# Altium schematic sheet bolid-rs485-usb-sd.SchDoc
size A3
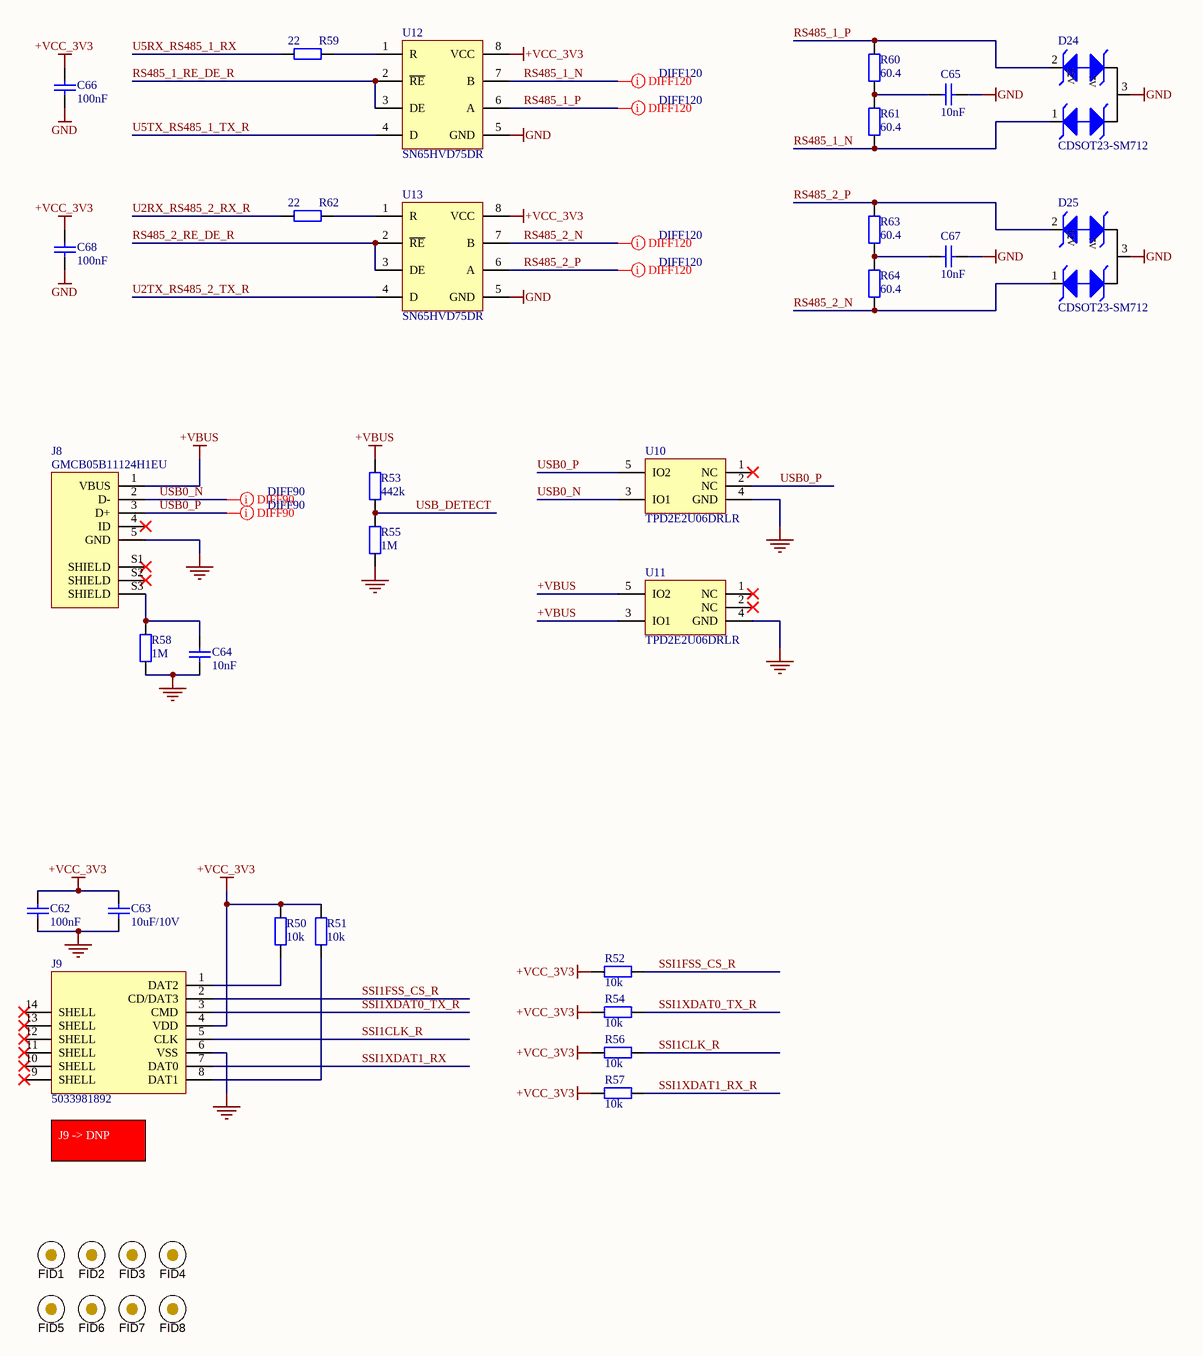
[diagram p0: bolid-rs485-usb-sd.SchDoc]

## Parts
C62  Value Displayed: 100nF  [C0402-CAPC100X50X55L22 - Tayio Yuden TDK]  (hidden comment: GRM155R71H104KE14D)
C63  Value Displayed: 10uF/10V  [C0805-CAPC200X125X135L50N - Taiyo YudenN]  (hidden comment: GRM21BR71A106KA73K)
C64  Value Displayed: 10nF  [C0402-CAPC100X50X55L22 - Tayio Yuden TDK]  (hidden comment: GCM155R71H103KA55D)
C65  Value Displayed: 10nF  [C0402-CAPC100X50X55L22 - Tayio Yuden TDK]  (hidden comment: GCM155R71H103KA55D)
C66  Value Displayed: 100nF  [C0402-CAPC100X50X55L22 - Tayio Yuden TDK]  (hidden comment: GRM155R71H104KE14D)
C67  Value Displayed: 10nF  [C0402-CAPC100X50X55L22 - Tayio Yuden TDK]  (hidden comment: GCM155R71H103KA55D)
C68  Value Displayed: 100nF  [C0402-CAPC100X50X55L22 - Tayio Yuden TDK]  (hidden comment: GRM155R71H104KE14D)
D24  CDSOT23-SM712  [Bourns SOT-23-3L SOT23-3P95_229X117L49X40N]
D25  CDSOT23-SM712  [Bourns SOT-23-3L SOT23-3P95_229X117L49X40N]
FID1  Fiducial  [Fiducial10-20]  (value not drawn)  (no BOM)
FID2  Fiducial  [Fiducial10-20]  (value not drawn)  (no BOM)
FID3  Fiducial  [Fiducial10-20]  (value not drawn)  (no BOM)
FID4  Fiducial  [Fiducial10-20]  (value not drawn)  (no BOM)
FID5  Fiducial  [Fiducial10-20]  (value not drawn)  (no BOM)
FID6  Fiducial  [Fiducial10-20]  (value not drawn)  (no BOM)
FID7  Fiducial  [Fiducial10-20]  (value not drawn)  (no BOM)
FID8  Fiducial  [Fiducial10-20]  (value not drawn)  (no BOM)
J8  GMCB05B11124H1EU  [AMPHENOL-GMCB05B11124H1EU]
J9  5033981892  [MOLEX MICROSD 5033981892]
R50  value 10k  [R0402-RESC100X50X40L22N]  (hidden comment: RC0402FR-0710KL)
R51  value 10k  [R0402-RESC100X50X40L22N]  (hidden comment: RC0402FR-0710KL)
R52  value 10k  [R0402-RESC100X50X40L22N]  (hidden comment: RC0402FR-0710KL)
R53  value 442k  [R0402-RESC100X50X40L22N]  (hidden comment: ERJ-2RKF4423X)
R54  value 10k  [R0402-RESC100X50X40L22N]  (hidden comment: RC0402FR-0710KL)
R55  value 1M  [R0402-RESC100X50X40L22N]  (hidden comment: AC0402FR-071ML)
R56  value 10k  [R0402-RESC100X50X40L22N]  (hidden comment: RC0402FR-0710KL)
R57  value 10k  [R0402-RESC100X50X40L22N]  (hidden comment: RC0402FR-0710KL)
R58  value 1M  [R0402-RESC100X50X40L22N]  (hidden comment: AC0402FR-071ML)
R59  value 22  [R0402-RESC100X50X40L22N]  (hidden comment: RC0402FR-1322RL)
R60  value 60.4  [R0603-RESC160X80X55L30N]  (hidden comment: RC0603FR-0760R4L)
R61  value 60.4  [R0603-RESC160X80X55L30N]  (hidden comment: RC0603FR-0760R4L)
R62  value 22  [R0402-RESC100X50X40L22N]  (hidden comment: RC0402FR-1322RL)
R63  value 60.4  [R0603-RESC160X80X55L30N]  (hidden comment: RC0603FR-0760R4L)
R64  value 60.4  [R0603-RESC160X80X55L30N]  (hidden comment: RC0603FR-0760R4L)
U10  TPD2E2U06DRLR  [TI SOT-5X3 DRL0005A SOTFL50P160X60-5N]
U11  TPD2E2U06DRLR  [TI SOT-5X3 DRL0005A SOTFL50P160X60-5N]
U12  SN65HVD75DR  [TI SOIC8 D0008A SOIC8P127_490X599X175L84X41N]
U13  SN65HVD75DR  [TI SOIC8 D0008A SOIC8P127_490X599X175L84X41N]

## Nets
+VBUS: J8.1(VBUS) R53.2 U11.3(IO1) U11.5(IO2)
+VCC_3V3: C62.2 C63.1 C66.1 C68.1 J9.4(VDD) R50.1 R51.1 R52.1 R54.1 R56.1 R57.1 U12.8(VCC) U13.8(VCC)
GND: C62.1 C63.2 C64.1 C65.2 C66.2 C67.2 C68.2 D24.3 D25.3 J8.5(GND) J9.6(VSS) R55.1 R58.1 U10.4(GND) U11.4(GND) U12.5(GND) U13.5(GND)
RS485_1_N: D24.1 R61.1 U12.7(B)
RS485_1_P: D24.2 R60.2 U12.6(A)
RS485_1_RE_DE_R: U12.2(~{RE}) U12.3(DE)
RS485_2_N: D25.1 R64.1 U13.7(B)
RS485_2_P: D25.2 R63.2 U13.6(A)
RS485_2_RE_DE_R: U13.2(~{RE}) U13.3(DE)
SSI1CLK_R: J9.5(CLK) R56.2
SSI1FSS_CS_R: J9.2(CD/DAT3) R52.2
SSI1XDAT0_TX_R: J9.3(CMD) R54.2
SSI1XDAT1_RX: J9.7(DAT0)
SSI1XDAT1_RX_R: R57.2
U2RX_RS485_2_RX_R: R62.1
U2TX_RS485_2_TX_R: U13.4(D)
U5RX_RS485_1_RX: R59.1
U5TX_RS485_1_TX_R: U12.4(D)
USB0_N: J8.2(D-) U10.3(IO1)
USB0_P: J8.3(D+) U10.2(NC) U10.5(IO2)
USB_DETECT: R53.1 R55.2
NetC64_2: C64.2 J8.S3(SHIELD) R58.2
NetC65_1: C65.1 R60.1 R61.2
NetC67_1: C67.1 R63.1 R64.2
NetJ9_1: J9.1(DAT2) R50.2
NetJ9_8: J9.8(DAT1) R51.2
NetR59_2: R59.2 U12.1(R)
NetR62_2: R62.2 U13.1(R)

Not connected (* = marked no-connect by the designer): FID1 X; FID2 X; FID3 X; FID4 X; FID5 X; FID6 X; FID7 X; FID8 X; J8 4(ID)* S1(SHIELD)* S2(SHIELD)*; J9 9(SHELL)* 10(SHELL)* 11(SHELL)* 12(SHELL)* 13(SHELL)* 14(SHELL)*; U10 1(NC)*; U11 1(NC)* 2(NC)*

## Layout directives
differential pair; differential pair class DIFF120: RS485_1_N, RS485_1_P, RS485_2_N, RS485_2_P
differential pair; differential pair class DIFF90: USB0_N, USB0_P

## Notes on the sheet
- (near J9) J9 -> DNP
- (in symbol CDSOT23-SM712) 7V

## Library data of the parts
C62 C66 C68 = GRM155R71H104KE14D: MLCC 0402 (1005) 100nF 10% 50V X7R; Manufacturer: Murata Electronics; Capacitance: 0.1 uF; Type: Chip Multilayer Ceramic Capacitor for General Purpose; Voltage Rating DC: 50 VDC; Capacitance - pF: 100000 pF; Class: Class 2; Supplier 1: Mouser; Manufacturer Part Number: GRM155R71H104KE14D; RoHS: RoHS Compliant; Category: Multilayer Ceramic Capacitors MLCC - SMD/SMT; Stock 1: 3511637; Pricing 1: 1=0.090, 10=0.038, 100=0.016, 500=0.012, 1000=0.009, 2500=0.008, 5000=0.007, 10000=0.005 (EUR); Height: 0.5 mm; Length: 1 mm; Package / Case: 0402 (1005 metric); Packaging: Cut Tape; Product: General Type MLCCs; Series: GRM; Termination Style: SMD/SMT; Tolerance: 10 %; Width: 0.5 mm; Brand: Murata Electronics; Capacitance - nF: 100 nF; Case Code - in: 0402; Case Code - mm: 1005; Dielectric: X7R; Maximum Operating Temperature: + 125 C; Minimum Operating Temperature: - 55 C; Product Type: Ceramic Capacitors; Standard Pack Qty: 10000; Subcategory: Capacitors; Termination: Standard; RoHS - Mouser: Y; Minimum Order Quantity: 1; Reeling: True; ComponentLink1URL: https://www.mouser.com/datasheet/2/281/murata_03052018_GRM_Series_1-1310166.pdf; ComponentLink1Description: https://www.mouser.com/datasheet/2/281/murata_03052018_GRM_Series_1-1310166.pdf; Value: 100nF; Supplier Part Number 1: 81-GRM155R71H104KE4D
C63 = GRM21BR71A106KA73K: MLCC 0805 (2012) 10uF 10% 10V X7R; Manufacturer: Murata Electronics; Type: Chip Multilayer Ceramic Capacitor for General Purpose; Voltage Rating DC: 10 VDC; Class: Class 2; Value: 10u; Supplier 1: Mouser; Manufacturer Part Number: GRM21BR71A106KA73K; RoHS: RoHS Compliant; Category: Multilayer Ceramic Capacitors MLCC - SMD/SMT; Stock 1: 108729; Pricing 1: 1=0.207, 10=0.144, 100=0.072, 500=0.050, 1000=0.043, 2500=0.040, 5000=0.036, 10000=0.030, 20000=0.028 (EUR); Capacitance: 10 uF; Height: 1.25 mm; Length: 2 mm; Package / Case: 0805 (2012 metric); Packaging: Cut Tape; Product: General Type MLCCs; Series: GRM; Termination Style: SMD/SMT; Tolerance: 10 %; Width: 1.25 mm; Brand: Murata Electronics; Case Code - in: 0805; Case Code - mm: 2012; Dielectric: X7R; Maximum Operating Temperature: + 125 C; Minimum Operating Temperature: - 55 C; Product Type: Ceramic Capacitors; Standard Pack Qty: 10000; Subcategory: Capacitors; Termination: Standard; RoHS - Mouser: Y; Minimum Order Quantity: 1; Reeling: True; ComponentLink1URL: https://www.mouser.com/datasheet/2/281/murata_03052018_GRM_Series_1-1310166.pdf; ComponentLink1Description: https://www.mouser.com/datasheet/2/281/murata_03052018_GRM_Series_1-1310166.pdf; Supplier Part Number 1: 81-GRM21BR71A106KA3K
C64 C65 C67 = GCM155R71H103KA55D: MLCC 0402 (1005) 10nF 10% 50V X7R; Manufacturer: Murata Electronics; Capacitance: 0.01 uF; Type: Chip Multilayer Ceramic Capacitors for Automotive; Voltage Rating DC: 50 VDC; Capacitance - pF: 10000 pF; Class: Class 2; Qualification: AEC-Q200; Value: 10n; Supplier 1: Mouser; Manufacturer Part Number: GCM155R71H103KA55D; RoHS: RoHS Compliant; Category: Multilayer Ceramic Capacitors MLCC - SMD/SMT; Stock 1: 7174893; Pricing 1: 1=0.090, 10=0.033, 100=0.015, 500=0.011, 1000=0.009, 2500=0.008, 5000=0.006, 10000=0.005, 20000=0.004 (EUR); Height: 0.5 mm; Length: 1 mm; Package / Case: 0402 (1005 metric); Packaging: Cut Tape; Product: Automotive MLCCs; Series: GCM; Termination Style: SMD/SMT; Tolerance: 10 %; Width: 0.5 mm; Brand: Murata Electronics; Capacitance - nF: 10 nF; Case Code - in: 0402; Case Code - mm: 1005; Dielectric: X7R; Maximum Operating Temperature: + 125 C; Minimum Operating Temperature: - 55 C; Product Type: Ceramic Capacitors; Standard Pack Qty: 10000; Subcategory: Capacitors; Termination: Standard; RoHS - Mouser: Y; Minimum Order Quantity: 1; Reeling: True; ComponentLink1URL: https://www.mouser.com/datasheet/2/281/murata_03122018_GCM_Series-1310150.pdf; ComponentLink1Description: https://www.mouser.com/datasheet/2/281/murata_03122018_GCM_Series-1310150.pdf; Supplier Part Number 1: 81-GCM155R71H103KA5D
D24 D25 = CDSOT23-SM712: TVS DIODE 7VWM/12VWM SOT23; Manufacturer: Bourns; Direction: Bidirectional; Capacitance: 75pF; Max Surge Current: 30A; Number of Elements: 2; Reverse Breakdown Voltage: 13.3V; Polarity: Bidirectional,Unidirectional; Clamping Voltage: 19V; Max Power Dissipation: 600W; Working Voltage: 12V; Peak Pulse Power: 400W; Power Line Protection: No; Leakage Current: 20uA; ESD Protection: Yes; Peak Pulse Current: 17A; Test Current: 1mA; Element Configuration: Dual; Diode Type: ZENER; Supplier 1: Mouser; Manufacturer Part Number: CDSOT23-SM712; RoHS: Yes; Category: TVS Diodes; Stock 1: 1112; Pricing 1: 1=1,63000, 10=1,44000, 50=1,44000, 100=1,14000, 250=1,11000, 500=0,94100, 1000=0,74300, 3000=0,69300, 6000=0,67500, 9000=0,62900, 10000=0,62900 (USD); Mount: Surface Mount; Case/Package: SOT-23; Number of Pins: 3; Contact Plating: Tin; Min Operating Temperature: -55°C; Max Operating Temperature: 150°C; Packaging: Tape and Reel; Package Quantity: 1; Number of Channels: 2; Breakdown Voltage: 13.3V; Termination: SMD/SMT; Number of Bidirectional Channels: 2; Reverse Standoff Voltage: 12V; Min Breakdown Voltage: 13.3V; Power Dissipation: 400W; Max Reverse Leakage Current: 20uA; Max Breakdown Voltage: 13.3V; Resistor Type: Zener; Series: -; Length: 3.04mm; Width: 0.055inch; Height: 1.11mm; Depth: 1.4mm; Radiation Hardening: No; REACH SVHC: No SVHC; RoHS Compliant: Yes; ComponentLink1URL: https://datasheet.ciiva.com/1281/1670933-1281331.pdf?src-supplier=Farnell; ComponentLink1Description: https://datasheet.ciiva.com/1281/1670933-1281331.pdf?src-supplier=Farnell; ComponentLink2URL: https://datasheet.ciiva.com/4510/cdsot23-sm712-25932-4510261.pdf?src-supplier=Mouser; ComponentLink2Description: https://datasheet.ciiva.com/4510/cdsot23-sm712-25932-4510261.pdf?src-supplier=Mouser; ComponentLink3URL: https://datasheet.ciiva.com/11193/cdsot23-sm712-11193846.pdf?src-supplier=Avnet; ComponentLink3Description: https://datasheet.ciiva.com/11193/cdsot23-sm712-11193846.pdf?src-supplier=Avnet; ComponentLink4URL: https://datasheet.ciiva.com/22696/1670933-22696779.pdf?src-supplier=Element14; ComponentLink4Description: https://datasheet.ciiva.com/22696/1670933-22696779.pdf?src-supplier=Element14; ComponentLink5URL: https://datasheet.ciiva.com/26828/getdatasheetpartid-418501-26828522.pdf?src-supplier=Verical; ComponentLink5Description: https://datasheet.ciiva.com/26828/getdatasheetpartid-418501-26828522.pdf?src-supplier=Verical; ComponentLink6URL: https://datasheet.ciiva.com/337/cdsot23-sm712-337451.pdf?src-supplier=Digi-Key; ComponentLink6Description: https://datasheet.ciiva.com/337/cdsot23-sm712-337451.pdf?src-supplier=Digi-Key; ComponentLink7URL: https://datasheet.ciiva.com/337/cdsot23-sm712-337452.pdf?src-supplier=Digi-Key; ComponentLink7Description: https://datasheet.ciiva.com/337/cdsot23-sm712-337452.pdf?src-supplier=Digi-Key; Supplier Part Number 1: 652-CDSOT23-SM712
FID1-FID8 = Fiducial: Fiducial mark on PCB
J8 = GMCB05B11124H1EU: Micro USB 2.0 Type B Receptacle Vertical SMT Shell Dip Length 1.7mm, Tape and Reel Packagin; Manufacturer: Amphenol; Supplier 1: Mouser; Manufacturer Part Number: GMCB05B11124H1EU; RoHS: No; Category: Connectors; Stock 1: 17853; Pricing 1: 1=1,01, 10=0,773, 50=0,641, 100=0,592, 1000=0,483, 10000=0,47 (USD); Supplier Part Number 1: 523-GMCB05B11124H1EU
J9 = 5033981892: 1.10mm Pitch microSD Memory Card Connector, Normal Mount Surface Mount, Push-Push Type, 1.28mm Height; Manufacturer: Molex; Plating: 154ConductorMaterial; Current Rating: 500mA; Voltage Rating (AC): 10V; Number of Contacts: 8; Gender: Male; Memory Type: 4498,11064MemoryType; Pitch: 1.1mm; Supplier 1: Mouser; Manufacturer Part Number: 5033981892; RoHS: Yes; Category: Memory Connectors; Stock 1: 16315; Pricing 1: 1=2,97, 10=1,94, 50=1,94, 100=1,68, 1000=1,5, 10000=1,35 (USD); Mount: Surface Mount; Contact Material: Bronze,Stainless Steel; Contact Plating: Gold; Housing Material: Thermoplastic; Min Operating Temperature: -25°C; Max Operating Temperature: 85°C; Packaging: Tape and Reel; Number of Rows: 1; Package Quantity: 2400; Termination: Solder; Orientation: Right Angle; Number of Circuits: 8; Series: 503398; Voltage Rating: 10V; Length: 13.6mm; Width: 14.05mm; Depth: 14.05mm; Halogen Free: Low Halogen; RoHS Compliant: Yes; Reach SVHC Compliant: Unknown; ComponentLink1URL: https://datasheet.ciiva.com/23941/1740947-23941665.pdf?src-supplier=Newark; ComponentLink1Description: https://datasheet.ciiva.com/23941/1740947-23941665.pdf?src-supplier=Newark; ComponentLink2URL: https://datasheet.ciiva.com/22744/1740946-22744573.pdf?src-supplier=Element14; ComponentLink2Description: https://datasheet.ciiva.com/22744/1740946-22744573.pdf?src-supplier=Element14; Supplier Part Number 1: 538-503398-1892
R50-R52 R54 R56 R57 = RC0402FR-0710KL: RES 0402 (1005) 10.0k 1% 0.0625W 50V Thick Film; Manufacturer: Yageo; Power Rating: 62.5 mW, 125 mW; Resistance: 10 kOhms; Temperature Coefficient: 100 PPM / C; Supplier 1: Mouser; Manufacturer Part Number: RC0402FR-0710KL; RoHS: RoHS Compliant; Category: Thick Film Resistors - SMD; Stock 1: 20942447; Pricing 1: 1=0.090, 10=0.011, 100=0.004, 1000=0.003, 10000=0.003 (EUR); Application: High Reliability; Features: -; Height: 0.35 mm; Length: 1 mm; Package / Case: -; Packaging: Cut Tape; Product: Thick Film Resistors SMD; Series: RC; Technology: Thick Film; Termination Style: SMD/SMT; Tolerance: 1 %; Type: General Purpose; Voltage Rating: 50 V; Width: 0.5 mm; Brand: Yageo; Mounting Style: PCB Mount; Case Code - in: 0402; Case Code - mm: 1005; Maximum Operating Temperature: + 155 C; Minimum Operating Temperature: - 55 C; Product Type: Thick Film Resistors; Standard Pack Qty: 10000; Subcategory: Resistors; RoHS - Mouser: Y; Minimum Order Quantity: 1; Reeling: True; ComponentLink1URL: https://www.mouser.com/datasheet/2/447/PYu-RC_Group_51_RoHS_L_10-1664068.pdf; ComponentLink1Description: https://www.mouser.com/datasheet/2/447/PYu-RC_Group_51_RoHS_L_10-1664068.pdf; Supplier Part Number 1: 603-RC0402FR-0710KL
R53 = ERJ-2RKF4423X: RES 0402 (1005) 442.0k 1% 0.100W 50V Thick Film; Manufacturer: Panasonic; Power Rating: 100 mW (1/10 W); Resistance: 442 kOhms; Temperature Coefficient: 100 PPM / C; Qualification: AEC-Q200; Supplier 1: Mouser; Manufacturer Part Number: ERJ-2RKF4423X; RoHS: RoHS Compliant By Exemption; Category: Thick Film Resistors - SMD; Stock 1: 56067; Pricing 1: 1=0.085, 10=0.025, 100=0.010, 1000=0.005, 2500=0.004, 5000=0.003, 10000=0.003 (EUR); Application: Automotive Grade; Features: Precision Resistors; Height: 0.35 mm; Length: 1 mm; Packaging: Cut Tape; Product: Thick Film Resistors SMD; Series: ERJ-2Rx; Technology: Thick Film; Termination Style: SMD/SMT; Tolerance: 1 %; Voltage Rating: 50 V; Width: 0.5 mm; Brand: Panasonic; Mounting Style: PCB Mount; Case Code - in: 0402; Case Code - mm: 1005; Maximum Operating Temperature: + 155 C; Minimum Operating Temperature: - 55 C; Product Type: Thick Film Resistors; Standard Pack Qty: 10000; Subcategory: Resistors; RoHS - Mouser: E; Minimum Order Quantity: 1; Reeling: True; ComponentLink1URL: https://www.mouser.com/datasheet/2/315/AOA0000C304-1149620.pdf; ComponentLink1Description: https://www.mouser.com/datasheet/2/315/AOA0000C304-1149620.pdf; Supplier Part Number 1: 667-ERJ-2RKF4423X
R55 R58 = AC0402FR-071ML: RES 0402 (1005) 1.00M 1% 0.0625W 50V Thick Film; Manufacturer: YAGEO; Power Rating: 62.5 mW (1/16 W); Resistance: 1 MOhms; Temperature Coefficient: 100 PPM / C; Qualification: AEC-Q200; Supplier 1: Mouser; Manufacturer Part Number: AC0402FR-071ML; RoHS: RoHS Compliant By Exemption; Category: Thick Film Resistors - SMD; Stock 1: 142366; Pricing 1: 1=0.085, 10=0.019, 100=0.008, 1000=0.004, 2500=0.003, 10000=0.003 (EUR); Application: Automotive Grade; Height: 0.32 mm; Length: 1 mm; Packaging: Cut Tape; Product: Thick Film Resistors General Purpose; Series: AC; Technology: Thick Film; Termination Style: SMD/SMT; Tolerance: 1 %; Type: General Purpose Resistor; Voltage Rating: 50 V; Width: 0.5 mm; Brand: YAGEO; Mounting Style: PCB Mount; Case Code - in: 0402; Case Code - mm: 1005; Maximum Operating Temperature: + 155 C; Minimum Operating Temperature: - 55 C; Product Type: Thick Film Resistors; Standard Pack Qty: 10000; Subcategory: Resistors; RoHS - Mouser: E; Minimum Order Quantity: 1; Reeling: True; ComponentLink1URL: https://www.mouser.com/datasheet/2/447/Yageo_PYu_AC_51_RoHS_L_7_1714230-1874691.pdf; ComponentLink1Description: https://www.mouser.com/datasheet/2/447/Yageo_PYu_AC_51_RoHS_L_7_1714230-1874691.pdf; Supplier Part Number 1: 603-AC0402FR-071ML
R59 R62 = RC0402FR-1322RL: RES 0402 (1005) 22.0 ohm 1% 0.0625W 50V Thick Film; Manufacturer: Yageo; Resistance: 22R; Power Rating: 62.5mW; Temperature Coefficient: 100ppm/°C; Supplier 1: Mouser; Manufacturer Part Number: RC0402FR-1322RL; RoHS: Yes; Category: Chip SMD Resistors; Stock 1: 130563; Pricing 1: 1=0,10000, 10=0,01200, 50=0,01200, 100=0,00500, 1000=0,00300, 10000=0,00300 (USD); Case/Package: 0402; Case Code (Imperial): 0402; Case Code (Metric): 1005; Weight: 2.3E-05oz; Contact Plating: Tin,Matte; Size Code: 0402; Min Operating Temperature: -55°C; Max Operating Temperature: 155°C; Voltage Rating: 50V; Tolerance: 1%; Packaging: Tape and Reel; Resistor Type: Thick Film; Termination: SMD/SMT; Series: RC; Length: 1mm; Width: 0.5mm; Height: 0.35mm; Radiation Hardening: No; Lead Free: Lead Free; RoHS Compliant: Yes; ComponentLink1URL: https://datasheet.ciiva.com/17423/pyu-rc0402-51-rohs-l-6-r-17423721.pdf?src-supplier=Future+Electronics; ComponentLink1Description: https://datasheet.ciiva.com/17423/pyu-rc0402-51-rohs-l-6-r-17423721.pdf?src-supplier=Future+Electronics; ComponentLink2URL: https://datasheet.ciiva.com/8890/pyu-rc0402-51-rohs-l-6-8890187.pdf?src-supplier=Avnet; ComponentLink2Description: https://datasheet.ciiva.com/8890/pyu-rc0402-51-rohs-l-6-8890187.pdf?src-supplier=Avnet; Supplier Part Number 1: 603-RC0402FR-1322RL
R60 R61 R63 R64 = RC0603FR-0760R4L: RES 0603 (1608) 60.4 ohm 1% 0.100W 75V Thick Film; Manufacturer: Yageo; Power Rating: 100 mW (1/10 W); Resistance: 60.4 Ohms; Temperature Coefficient: 100 PPM / C; Supplier 1: Mouser; Manufacturer Part Number: RC0603FR-0760R4L; RoHS: RoHS Compliant By Exemption; Category: Thick Film Resistors - SMD; Stock 1: 301644; Pricing 1: 1=0.090, 10=0.016, 100=0.005, 5000=0.003 (EUR); Application: High Reliability; Features: -; Height: 0.45 mm; Length: 1.6 mm; Package / Case: -; Packaging: Cut Tape; Product: Thick Film Resistors SMD; Series: RC; Technology: Thick Film; Termination Style: SMD/SMT; Tolerance: 1 %; Type: General Purpose; Voltage Rating: 75 V; Width: 0.8 mm; Brand: Yageo; Mounting Style: PCB Mount; Case Code - in: 0603; Case Code - mm: 1608; Maximum Operating Temperature: + 155 C; Minimum Operating Temperature: - 55 C; Product Type: Thick Film Resistors; Standard Pack Qty: 5000; Subcategory: Resistors; RoHS - Mouser: E; Minimum Order Quantity: 1; Reeling: True; ComponentLink1URL: https://www.mouser.com/datasheet/2/447/PYu-RC_Group_51_RoHS_L_10-1664068.pdf; ComponentLink1Description: https://www.mouser.com/datasheet/2/447/PYu-RC_Group_51_RoHS_L_10-1664068.pdf; Supplier Part Number 1: 603-RC0603FR-0760R4L
U10 U11 = TPD2E2U06DRLR: TVS DIODE 5.5VWM 12.4VC 5SOT; Manufacturer: Texas Instruments; Direction: Unidirectional; Capacitance: 1.9pF; Reverse Standoff Voltage: 5.5V; Min Breakdown Voltage: 6.5V; Clamping Voltage: 12.4V; Peak Pulse Power: 85W; Power Line Protection: Yes; Breakdown Voltage: 8.5V; Peak Pulse Current: 5.5A; Number of Channels: 2; Interface: LVDS,USB,Ethernet; Supplier 1: Mouser; Manufacturer Part Number: TPD2E2U06DRLR; RoHS: Yes; Category: Integrated Circuits (ICs); Stock 1: 73856; Pricing 1: 1=0,49, 10=0,356, 50=0,356, 100=0,254, 1000=0,173, 10000=0,159 (USD); Mount: Surface Mount; Case/Package: SOT-5; Number of Pins: 5; Min Operating Temperature: -40°C; Max Operating Temperature: 125°C; Packaging: Tape and Reel; Working Voltage: 5.5V; Polarity: Unidirectional; Termination: SMD/SMT; Package Quantity: 4000; Series: -; Operating Supply Voltage: 5.5V; Number of Unidirectional Channels: 2; Lead Free: Lead Free; RoHS Compliant: Yes; Reach SVHC Compliant: No; ComponentLink1URL: https://datasheet.ciiva.com/48533/tpd2e2u06-48533343.pdf?src-supplier=Avnet; ComponentLink1Description: https://datasheet.ciiva.com/48533/tpd2e2u06-48533343.pdf?src-supplier=Avnet; Supplier Part Number 1: 595-TPD2E2U06DRLR
U12 U13 = SN65HVD75DR: IC TXRX RS485 3.3V LP 8SOIC; Manufacturer: Texas Instruments; Nominal Supply Current: 950uA; Number of Receivers: 1; Data Rate: 20Mbps; Logic Function: Transceiver; Simplex/Duplex: Half Duplex; Receiver Hysteresis: 80mV; Min Supply Voltage: 3V; Max Supply Voltage: 3.6V; Interface: RS-422,RS-485; Supplier 1: Mouser; Manufacturer Part Number: SN65HVD75DR; RoHS: Yes; Category: RS-232 / RS-422 / RS-485 Interface ICs; Pricing 1: 1=3,10000, 10=2,79000, 25=2,63000, 50=2,63000, 100=2,28000, 250=2,17000, 500=1,94000, 1000=1,70000, 2500=1,69000, 10000=1,69000 (USD); Case/Package: D; Number of Pins: 8; Contact Plating: Gold; Min Operating Temperature: -40°C; Max Operating Temperature: 125°C; Package Quantity: 2500; Operating Supply Voltage: 3.3V; Packaging: Tape and Reel; Number of Drivers: 1; Series: -; Supply Current: 950uA; Number of Transmitters: 1; Number of Transceivers: 1; Radiation Hardening: No; Lead Free: Lead Free; RoHS Compliant: Yes; REACH SVHC: No SVHC; ComponentLink2URL: https://datasheet.ciiva.com/26946/getdatasheetpartid-520468-26946072.pdf?src-supplier=Verical; ComponentLink2Description: https://datasheet.ciiva.com/26946/getdatasheetpartid-520468-26946072.pdf?src-supplier=Verical; ComponentLink3URL: https://datasheet.ciiva.com/14195/sn65hvd75-14195222.pdf?src-supplier=Avnet; ComponentLink3Description: https://datasheet.ciiva.com/14195/sn65hvd75-14195222.pdf?src-supplier=Avnet; ComponentLink4URL: https://datasheet.ciiva.com/6635/sn65hvd75-6635111.pdf?src-supplier=Digi-Key; ComponentLink4Description: https://datasheet.ciiva.com/6635/sn65hvd75-6635111.pdf?src-supplier=Digi-Key; Supplier Part Number 1: 595-SN65HVD75DR